# EAGLE schematic Full Water Level Detector Project Schematic (EAGLE 7.4.0)
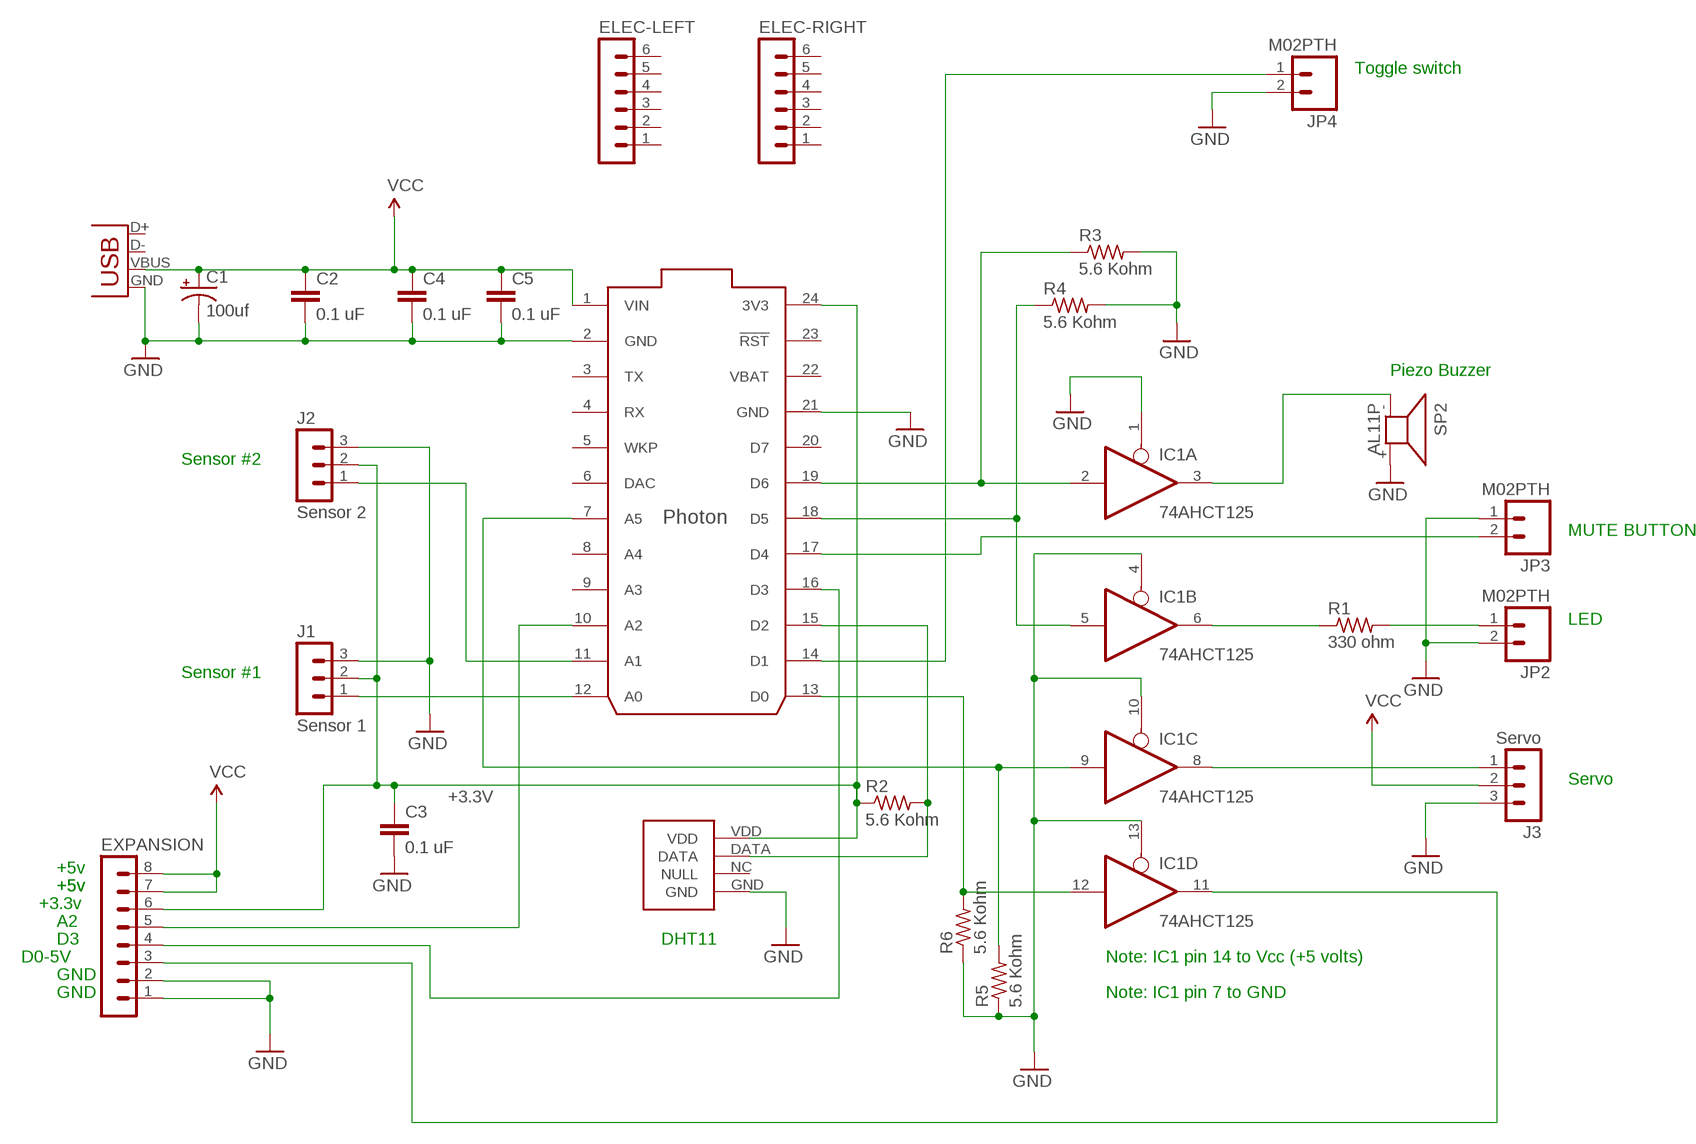
[diagram p0: schematic, sheet 1]

## Parts
C1  100uf  CAP_POLPTH1  [CPOL-RADIAL-100UF-25V]
C2  0.1 uF  CAPPTH  [CAP-PTH-SMALL]
C3  0.1 uF  CAPPTH  [CAP-PTH-SMALL]
C4  0.1 uF  CAPPTH  [CAP-PTH-SMALL]
C5  0.1 uF  CAPPTH  [CAP-PTH-SMALL]
ELEC-LEFT  MA06-1  [MA06-1]
ELEC-RIGHT  MA06-1  [MA06-1]
EXPANSION  MA08-1  [MA08-1]
IC1  74AHCT125  74125N  [DIL14]
J1  Sensor 1  MA03-1  [MA03-1]
J2  Sensor 2  MA03-1  [MA03-1]
J3  Servo  MA03-1  [MA03-1]
JP1  USB-B  USBPTH  [USB-B-PTH]
JP2  M02PTH  [1X02]
JP3  M02PTH  [1X02]
JP4  M02PTH  [1X02]
R1  330 ohm  R-US_0309/12  [0309/12]
R2  5.6 Kohm  R-US_0309/12  [0309/12]
R3  5.6 Kohm  R-US_0309/12  [0309/12]
R4  5.6 Kohm  R-US_0309/12  [0309/12]
R5  5.6 Kohm  R-US_0309/12  [0309/12]
R6  5.6 Kohm  R-US_0309/12  [0309/12]
SP2  AL11P  [AL11P]
U$1  PHOTON_SMD  [PHOTON_SMD]
U$2  DHT22  [DHT22]

## Nets
+3.3V: C3.1 EXPANSION.6 J1.2 J2.2 R2.1 U$1.24(3V3) U$2.VDD
GND: C1.2(-) C2.2 C3.2 C4.2 C5.2 EXPANSION.1 EXPANSION.2 IC1.1(A:OE) IC1.4(B:OE) IC1.10(C:OE) IC1.13(D:OE) J1.3 J2.3 J3.3 JP1.GND JP2.2 JP3.1 JP4.2 R3.2 R4.2 R5.1 R6.1 SP2.+ U$1.2(GND) U$1.21(GND) U$2.GND
N$1: IC1.8(C:O) J3.1
N$2: J2.1 U$1.11(A1)
N$3: J1.1 U$1.12(A0)
N$4: IC1.2(A:I) R3.1 U$1.19(D6)
N$6: IC1.3(A:O) SP2.-
N$7: IC1.9(C:I) R5.2 U$1.7(A5)
N$9: IC1.6(B:O) R1.1
N$10: JP2.1 R1.2
N$11: JP3.2 U$1.17(D4)
N$14: EXPANSION.4 U$1.16(D3)
N$15: EXPANSION.3 IC1.11(D:O)
N$16: EXPANSION.5 U$1.10(A2)
N$17: IC1.12(D:I) R6.2 U$1.13(D0)
N$19: R2.2 U$1.15(D2) U$2.DATA
N$22: JP4.1 U$1.14(D1)
N$23: IC1.5(B:I) R4.1 U$1.18(D5)
VCC: C1.1(+) C2.1 C4.1 C5.1 EXPANSION.7 EXPANSION.8 J3.2 JP1.VBUS U$1.1(VIN)
Unconnected: ELEC-LEFT.1 ELEC-LEFT.2 ELEC-LEFT.3 ELEC-LEFT.4 ELEC-LEFT.5 ELEC-LEFT.6 ELEC-RIGHT.1 ELEC-RIGHT.2 ELEC-RIGHT.3 ELEC-RIGHT.4 ELEC-RIGHT.5 ELEC-RIGHT.6 JP1.D+ JP1.D- U$1.3(TX) U$1.4(RX) U$1.5(WKP) U$1.6(DAC) U$1.8(A4) U$1.9(A3) U$1.20(D7) U$1.23(!RST) U$1.25(EN) U$1.26(!SETUP) U$1.27(RGB_RED) U$1.28(RGB_GREEN) U$1.29(RGB_BLUE) U$1.30(USB_D-) U$1.31(USB_D+) U$2.NC(NULL)

## Notes on the sheet
- Toggle switch
- Piezo Buzzer
- Sensor #2
- MUTE BUTTON
- LED
- Sensor #1
- Servo
- +5v
- +5v | +5v
- +3.3v
- A2
- D3 | DHT11
- D0-5V | Note: IC1 pin 14 to Vcc (+5 volts)
- GND
- GND | Note: IC1 pin 7 to GND

## Power pins joined to a net without a drawn wire
GND: IC1.7(P:GND)
VBAT: U$1.22(VBAT)
VCC: IC1.14(P:VCC)

## Library data of the parts
C1 = SparkFun-Capacitors:CAP_POL: Capacitor Polarized These are standard SMD and PTH capacitors. Normally 10uF, 47uF, and 100uF in electrolytic and tantalum varieties. Always verify the external diameter of the through hole cap, it varies with capacity, voltage, and manufacturer. The EIA devices should be standard.
C2-C5 = SparkFun-Passives:CAP: Capacitor Standard 0603 ceramic capacitor, and 0.1" leaded capacitor.
ELEC-LEFT ELEC-RIGHT = con-lstb:MA06-1: PIN HEADER; OC_FARNELL: unknown; OC_NEWARK: unknown
EXPANSION = con-lstb:MA08-1: PIN HEADER; OC_FARNELL: unknown; OC_NEWARK: unknown
IC1 = 74xx-us:74*125: Quad bus BUFFER, 3-state
J1-J3 = con-lstb:MA03-1: PIN HEADER; OC_FARNELL: unknown; OC_NEWARK: unknown
JP1 = SparkFun-Connectors:USB: USB Connectors USB-B-PTH is fully proven SKU : PRT-00139/CONN-08278 USB-miniB is fully proven SKU : PRT-00587 USB-A-PCB is untested. USB-A-H is throughly reviewed, but untested. Spark Fun Electronics SKU : PRT-00437 USB-B-SMT is throughly reviewed, but untested. Needs silkscreen touching up. USB-A-S has not been used/tested USB-MB-H has not been used/tested USB-MICROB has been used. CONN-09505; PROD_ID: CONN-08278
JP2-JP4 = SparkFun-Connectors:M02: Standard 2-pin 0.1" header. Use with - straight break away headers ( PRT-00116) - right angle break away headers (PRT-00553) - swiss pins (PRT-00743) - machine pins (PRT-00117) - female headers (PRT-00115) Molex polarized connector foot print use with: PRT-08233 with associated crimp pins and housings. 2.54_SCREWTERM for use with PRT-10571. 3.5mm Screw Terminal footprints for PRT-08084 5mm Screw Terminal footprints for use with PRT-08433
R1-R6 = rcl:R-US_: RESISTOR, American symbol
SP2 = buzzer:AL11P: SPEAKER Source: Buerklin; OC_FARNELL: unknown; OC_NEWARK: unknown
U$1 = Spark:PHOTON_SMD: Photon (without headers) - designed to be surface mounted with 7 extra exposed pads on the bottom of the board which include, 3 RGB LED outputs, /SETUP, EN (3.3V SMPS enable input), USB D+ and USB D-.
U$2 = Spark:DHT22